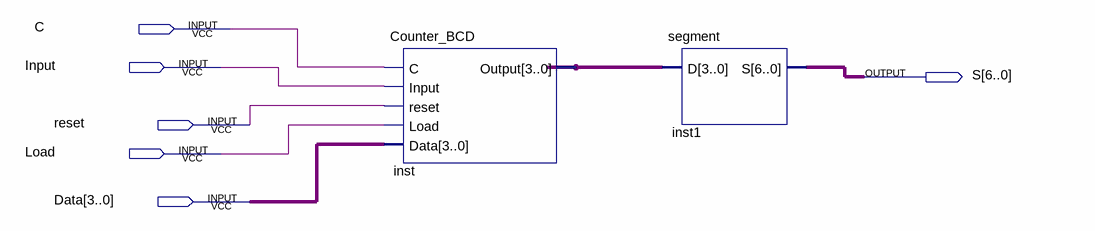
[diagram p0: schematic sheet]
// Quartus schematic segcounter.bdf as structural Verilog: 2 symbols, 6 pins
module segcounter (
  input  C,
  input  Input,
  input  reset,
  input  Load,
  input  [3:0] Data,
  output [6:0] S
);

  wire [3:0] inst_output;

  Counter_BCD inst (.C(C), .Input(Input), .reset(reset), .Load(Load), .Data(Data), .Output(inst_output));
  segment inst1 (.D(inst_output), .S(S));
endmodule
